# EAGLE board electrosteel2021_synthboards1 (EAGLE 9.6.2)
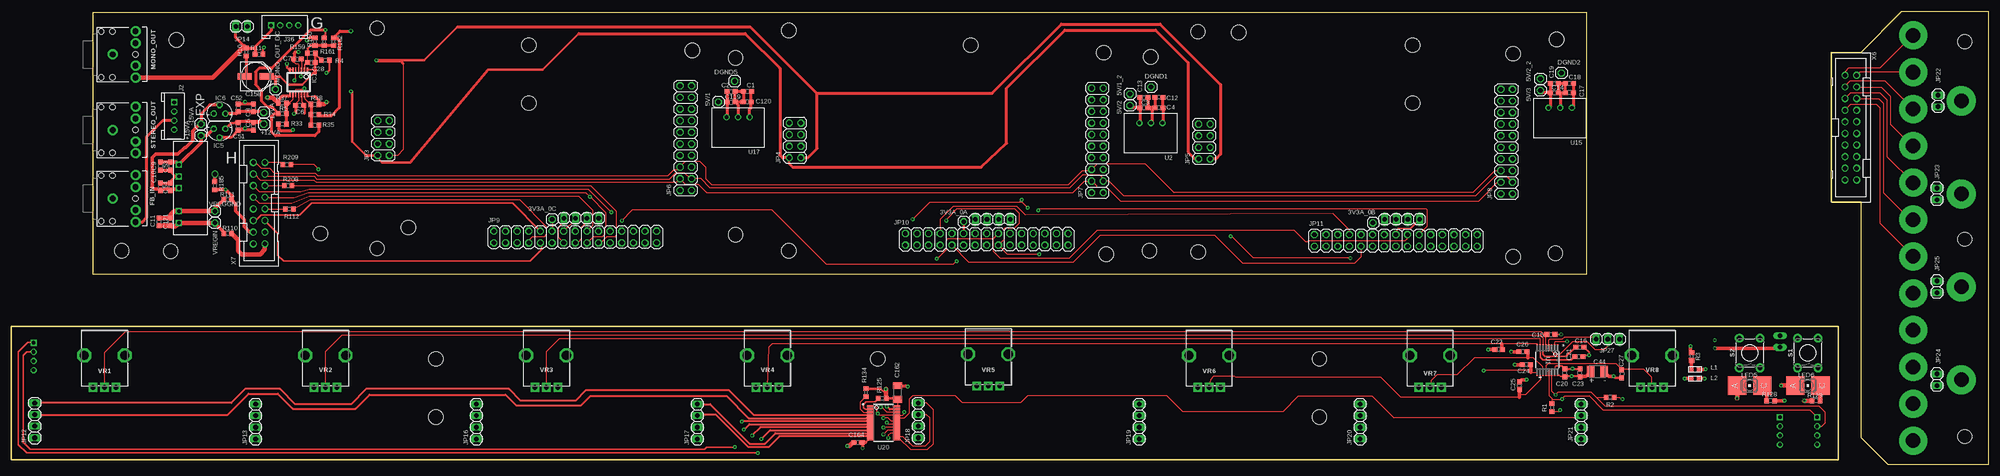
[diagram p2: board, top side]
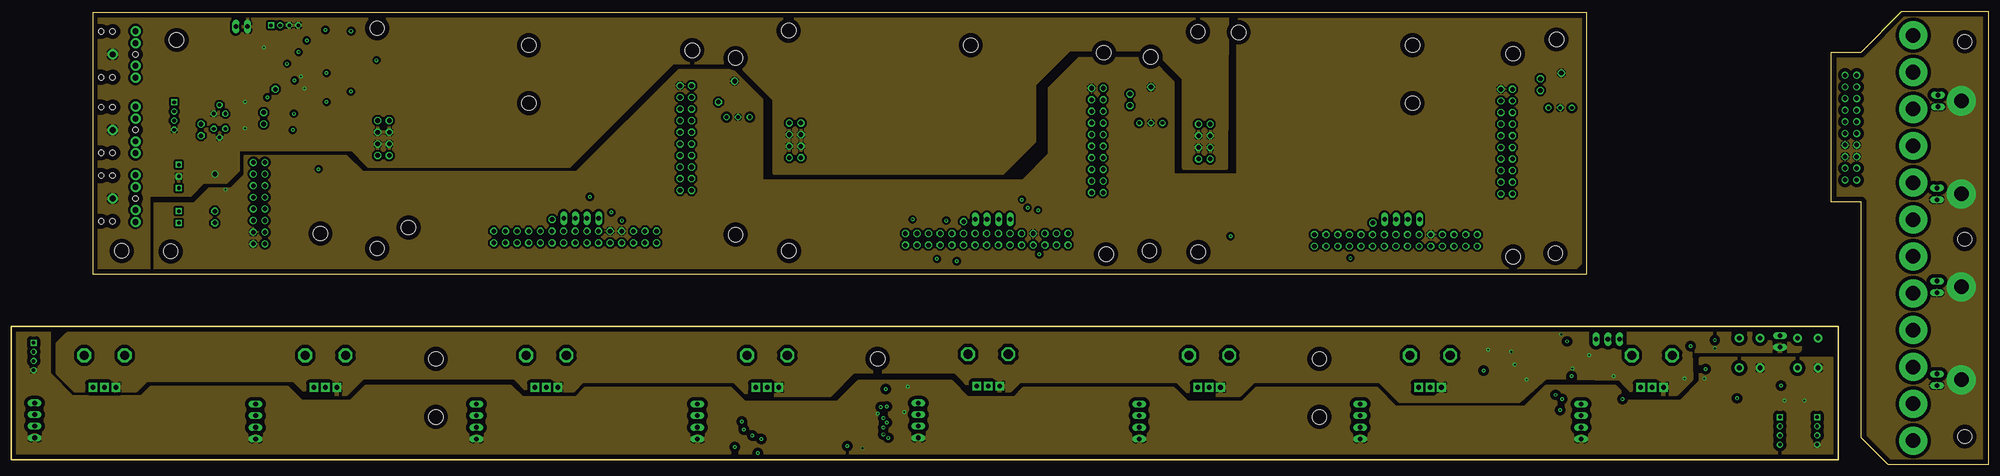
[diagram p3: board, inner layer Route2]
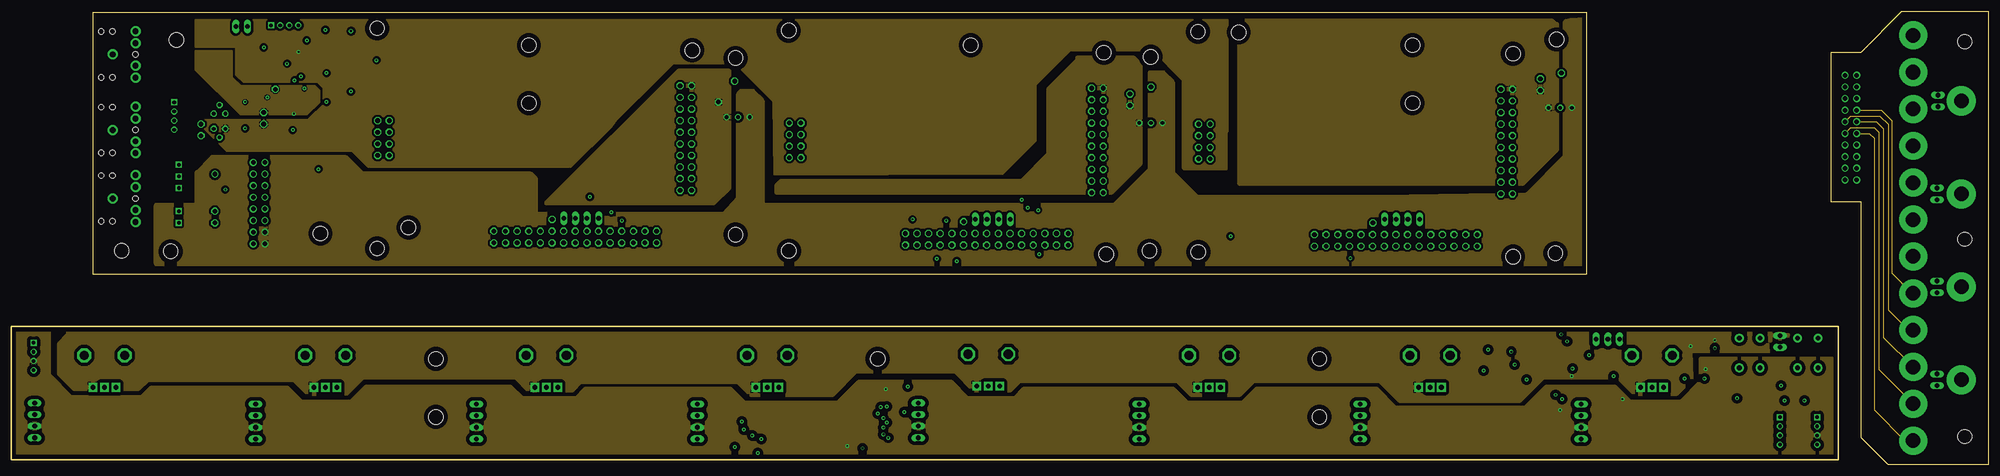
[diagram p4: board, inner layer Route15]
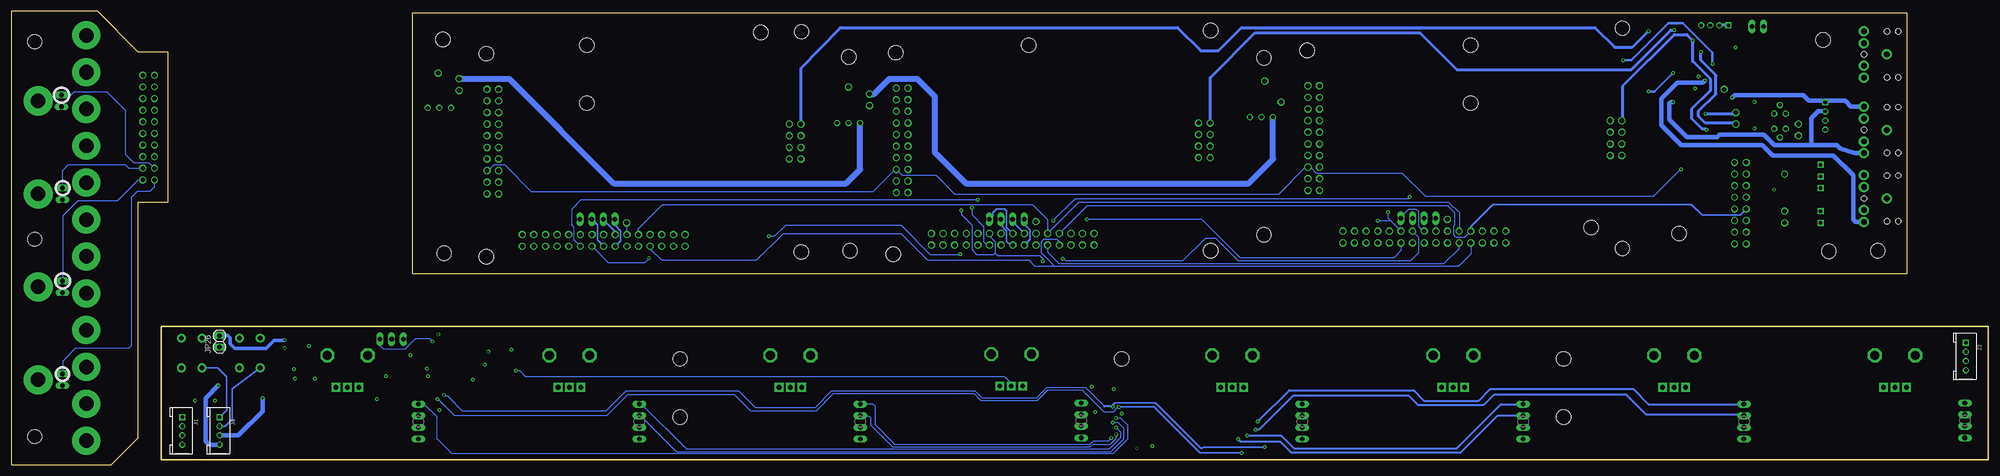
[diagram p5: board, bottom side, seen from below]

Size 431.8 x 99.06 mm. Coordinates in mm from the lower left corner, seen from the top.
Outline: 17.78,98.81 17.78,41.66 344.17,41.66 344.17,98.81 17.78,98.81
Outline: 0,1.02 0,30.23 399.03,30.23 399.03,1.02 0,1.02
Outline: 397.51,90.17 404.11,90.17 413,99.06 431.8,99.06 431.8,0 409.96,0 404.11,5.84 404.11,57.4 397.51,57.4 397.51,90.17
Copper layers (1+2*15+16): Top 0.035mm / dielectric 0.5mm / Route2 0.035mm / dielectric 0.5mm / Route15 0.035mm / dielectric 0.5mm / Bottom 0.035mm
Design rules "default *": minimum track width 6mil, minimum drill 0.35mm, track to track 9mil, track to pad 9mil, pad to pad 9mil, via to via 9mil, smd to smd 9mil, copper to edge 40mil, drill to drill 6mil, minimum pad ring 10mil, minimum via ring 8mil, stop-mask expansion 4mil, vias tented up to drill 0mil, thermal gap 10mil
Holes 3.17 mm at 79.88,95.38 148.72,90.55 79.88,47.24 169.8,94.87 238.63,90.04 169.85,46.71 259.21,94.64 328.02,89.81 259.28,46.46 113.03,78.99 306.07,78.99 36.07,92.84 328.04,45.47 268.1,94.49 86.74,51.82 239.14,45.97 34.8,46.61 248.62,46.71 337.26,46.2 337.52,92.94 248.87,89.13 158.19,88.87 24.08,46.71 158.19,50.27 67.51,50.52 306.07,91.69 209.55,91.69 113.03,91.69 92.71,23.11 92.71,10.41 189.23,23.11 285.75,23.11 285.75,10.41
Holes 3.05 mm at 426.72,92.46 426.72,6.1 426.72,49.28
Milling: 17 lines

## Footprints (pad centres in the part's own frame; a part is rotated, then mirrored left to right if it is on the bottom)
1X01 = drill 1.016 octagon: 1 0,0
C0603 = smd 1.1 x 1: 1 -0.85,0; 2 0.85,0
SMC_B = smd 1.6 x 2.4: + -1.5,0; - 1.5,0
PANASONIC_D = smd 3 x 1.4: + 2.4,0; - -2.4,0
C1206K = smd 1.5 x 2: 1 -1.5,0; 2 1.5,0
AUDIO-JACK-KIT = drill 1.3 pad 2.184: RING 5,5.1; RSH 5,2.5; SLEEVE 0,0; TIP 5,-5.1; TSH 5,-2.5 | hole 1.2: 0,5; -2.5,5; -2.5,-5; 0,-5; 5,0
TSSOP14 = smd 0.305 x 0.991: 1 -1.905,-2.718; 2 -1.27,-2.718; 3 -0.635,-2.718; 4 0,-2.718; 5 0.635,-2.718; 6 1.27,-2.718; 7 1.905,-2.718; 8 1.905,2.718; 9 1.27,2.718; 10 0.635,2.718; 11 0,2.718; 12 -0.635,2.718; 13 -1.27,2.718; 14 -1.905,2.718
78LXX = drill 0.813 octagon: GND 0,1.905; IN 1.27,0; OUT -1.27,0
79LXX = drill 0.813 octagon: GND -1.27,0; IN 0,1.905; OUT 1.27,0
HW4-2.0 = drill 0.8 pad 1.27 square: 1 -3,0 | drill 0.8 pad 1.27: 2 -1,0; 3 1,0; 4 3,0
1X04 = drill 1.016 long: 1 -3.81,0; 2 -1.27,0; 3 1.27,0; 4 3.81,0
2X04 = drill 1.016 octagon: 1 -3.81,-1.27; 2 -3.81,1.27; 3 -1.27,-1.27; 4 -1.27,1.27; 5 1.27,-1.27; 6 1.27,1.27; 7 3.81,-1.27; 8 3.81,1.27
2X10 = drill 1.016 octagon: 1 -11.43,-1.27; 2 -11.43,1.27; 3 -8.89,-1.27; 4 -8.89,1.27; 5 -6.35,-1.27; 6 -6.35,1.27; 7 -3.81,-1.27; 8 -3.81,1.27; 9 -1.27,-1.27; 10 -1.27,1.27; 11 1.27,-1.27; 12 1.27,1.27; 13 3.81,-1.27; 14 3.81,1.27; 15 6.35,-1.27; 16 6.35,1.27; 17 8.89,-1.27; 18 8.89,1.27; 19 11.43,-1.27; 20 11.43,1.27
2X15 = drill 1.016 octagon: 1 -17.78,-1.27; 2 -17.78,1.27; 3 -15.24,-1.27; 4 -15.24,1.27; 5 -12.7,-1.27; 6 -12.7,1.27; 7 -10.16,-1.27; 8 -10.16,1.27; 9 -7.62,-1.27; 10 -7.62,1.27; 11 -5.08,-1.27; 12 -5.08,1.27; 13 -2.54,-1.27; 14 -2.54,1.27; 15 0,-1.27; 16 0,1.27; 17 2.54,-1.27; 18 2.54,1.27; 19 5.08,-1.27; 20 5.08,1.27; 21 7.62,-1.27; 22 7.62,1.27; 23 10.16,-1.27; 24 10.16,1.27; 25 12.7,-1.27; 26 12.7,1.27; 27 15.24,-1.27; 28 15.24,1.27; 29 17.78,-1.27; 30 17.78,1.27
1X02 = drill 1.016 long: 1 -1.27,0; 2 1.27,0
1X03 = drill 1.016 long: 1 -2.54,0; 2 0,0; 3 2.54,0
INDUCTOR_L0603 = smd 0.889 x 0.889: 1 -0.762,0; 2 0.762,0
P-LCC-2 = smd 4 x 4: A 0,2.75; C 0,-2.75
R0603 = smd 1 x 1.1: 1 -0.85,0; 2 0.85,0
TACTILE_SWITCH_PTH_6.0MM = drill 1.016 pad 1.88: 1 -3.251,2.261; 2 3.251,2.261; 3 -3.251,-2.261; 4 3.251,-2.261
21-0055H_16_MXM = smd 1.46 x 0.356: 1 -2.724,2.223; 2 -2.724,1.587; 3 -2.724,0.953; 4 -2.724,0.318; 5 -2.724,-0.318; 6 -2.724,-0.953; 7 -2.724,-1.587; 8 -2.724,-2.223; 9 2.724,-2.223; 10 2.724,-1.587; 11 2.724,-0.953; 12 2.724,-0.318; 13 2.724,0.318; 14 2.724,0.953; 15 2.724,1.587; 16 2.724,2.223
DC-DC_CONVERTER_78XX = drill 0.8: GND 0,0; VIN -2.54,0; VOUT 2.54,0
SOP65P640X120-24N = smd 1.57 x 0.41: 1 -2.87,3.575; 2 -2.87,2.925; 3 -2.87,2.275; 4 -2.87,1.625; 5 -2.87,0.975; 6 -2.87,0.325; 7 -2.87,-0.325; 8 -2.87,-0.975; 9 -2.87,-1.625; 10 -2.87,-2.275; 11 -2.87,-2.925; 12 -2.87,-3.575; 13 2.87,-3.575; 14 2.87,-2.925; 15 2.87,-2.275; 16 2.87,-1.625; 17 2.87,-0.975; 18 2.87,-0.325; 19 2.87,0.325; 20 2.87,0.975; 21 2.87,1.625; 22 2.87,2.275; 23 2.87,2.925; 24 2.87,3.575
CMR0512S3C = drill 0.8 square: P$1 -7.62,0; P$2 -5.08,0; P$3 0,0; P$4 2.54,0; P$5 5.08,0
POT-PTH-ALPS = drill 1 pad 1.88 square: P$1 7,-2.5; P$2 7,0; P$3 7,2.5 | drill 2 octagon: P$4 0,-4.4; P$5 0,4.4
PAK100/2500-20 = drill 1 pad 1.422: 1 -11.43,-1.27; 2 -11.43,1.27; 3 -8.89,-1.27; 4 -8.89,1.27; 5 -6.35,-1.27; 6 -6.35,1.27; 7 -3.81,-1.27; 8 -3.81,1.27; 9 -1.27,-1.27; 10 -1.27,1.27; 11 1.27,-1.27; 12 1.27,1.27; 13 3.81,-1.27; 14 3.81,1.27; 15 6.35,-1.27; 16 6.35,1.27; 17 8.89,-1.27; 18 8.89,1.27; 19 11.43,-1.27; 20 11.43,1.27
PAK100/2500-16 = drill 1 pad 1.422: 1 -8.89,-1.27; 2 -8.89,1.27; 3 -6.35,-1.27; 4 -6.35,1.27; 5 -3.81,-1.27; 6 -3.81,1.27; 7 -1.27,-1.27; 8 -1.27,1.27; 9 1.27,-1.27; 10 1.27,1.27; 11 3.81,-1.27; 12 3.81,1.27; 13 6.35,-1.27; 14 6.35,1.27; 15 8.89,-1.27; 16 8.89,1.27

## Placement (x,y rotation side)
3V3A_0A  PINHD-1X1  [1X01]  208.03,53.09 0 top
3V3A_0B  PINHD-1X1  [1X01]  297.43,52.83 0 top
3V3A_0C  PINHD-1X1  [1X01]  118.11,53.59 0 top
5V/1  PINHD-1X1  [1X01]  154.43,79.25 0 top
5V/1_2  PINHD-1X1  [1X01]  244.35,81.03 0 top
5V/2  PINHD-1X1  [1X01]  244.35,78.49 0 top
5V/2_2  PINHD-1X1  [1X01]  334.01,84.33 0 top
5V/3  PINHD-1X1  [1X01]  334.01,81.79 0 top
+12VA  PINHD-1X1  [1X01]  55.12,74.42 0 top
+15VA  PINHD-1X1  [1X01]  41.4,71.88 180 top
-12VA  PINHD-1X1  [1X01]  55.12,76.96 180 top
-15VA  PINHD-1X1  [1X01]  41.4,74.42 180 top
C1  .1uf  [C0603]  160.78,81.53 180 top
C2  .1uf  [C0603]  157.23,81.53 0 top
C3  .01uf  [C0603]  247.4,77.98 0 top
C4  .01uf  [C0603]  250.7,77.98 180 top
C5  .1uf  [C0603]  52.83,73.91 270 top
C6  .1uf  [C0603]  62.99,78.49 180 top
C7  .1uf  [C0603]  62.48,88.65 0 top
C8  .1uf  [C0603]  52.83,77.98 270 top
C9  .1uf  [C0603]  32.51,65.28 270 top
C10  .1uf  [C0603]  32.51,60.71 270 top
C11  .1uf  [C0603]  32.26,53.09 90 top
C12  .1uf  [C0603]  250.7,80.26 180 top
C13  .1uf  [C0603]  247.4,80.26 0 top
C14  .01uf  [C0603]  337.06,81.28 0 top
C15  .01uf  [C0603]  336.3,28.45 0 top
C16  .01uf  [C0603]  342.65,25.65 0 top
C17  .01uf  [C0603]  340.36,81.28 180 top
C18  .1uf  [C0603]  340.36,83.31 180 top
C19  .1uf  [C0603]  337.06,83.31 0 top
C20  .01uf  [C0603]  339.34,20.07 90 top
C21  .01uf  [C0603]  342.39,23.62 0 top
C22  .01uf  [C0603]  324.87,25.15 180 top
C23  .1uf  [C0603]  342.65,20.07 90 top
C24  .01uf  [C0603]  330.96,21.84 180 top
C25  .01uf  [C0603]  329.44,17.27 90 top
C26  .01uf  [C0603]  330.2,24.64 180 top
C27  .01uf  [C0603]  351.79,19.81 270 top
C28  22pf  [C0603]  65.53,87.88 0 top
C44  10uf  [SMC_B]  346.46,20.32 0 top
C51  .01uf  [C0603]  49.53,73.91 270 top
C52  .01uf  [C0603]  49.53,77.98 270 top
C53  .01uf  [C0603]  34.8,65.28 270 top
C54  .01uf  [C0603]  34.8,60.71 270 top
C119  .01uf  [C0603]  157.23,79.25 0 top
C120  .01uf  [C0603]  160.73,79.27 180 top
C121  .01uf  [C0603]  34.8,53.09 90 top
C158  22uf  [PANASONIC_D]  53.34,84.84 0 top
C162  1uf  [C1206K]  193.55,15.75 90 top
C164  .1uf  [C0603]  184.91,4.83 0 top
DGND1  PINHD-1X1  [1X01]  248.92,82.55 0 top
DGND2  PINHD-1X1  [1X01]  338.58,85.6 0 top
DGND5  PINHD-1X1  [1X01]  157.99,83.82 180 top
FB_IN  AUDIO_JACK_3.5MM_KIT  [AUDIO-JACK-KIT]  22.1,58.17 0 top
IC1  OPA4344E  [TSSOP14]  62.74,83.57 180 top
IC5  [78LXX]  45.47,73.41 180 top
IC6  [79LXX]  45.47,76.71 0 top
J1  4P-2.0  [HW4-2.0]  394.46,7.37 270 bottom
J2  4P-2.0  [HW4-2.0]  35.56,76.2 270 top
J3  4P-2.0  [HW4-2.0]  4.83,23.62 270 bottom
J4  4P-2.0  [HW4-2.0]  386.33,7.37 270 bottom
J36  4P-2.0  [HW4-2.0]  59.69,96.01 0 top
JP1  PINHD-1X4  [1X04]  124.46,53.85 180 top
JP2  PINHD-1X4  [1X04]  214.38,53.59 180 top
JP3  PINHD-2X4  [2X04]  81.28,71.37 90 top
JP4  PINHD-2X4  [2X04]  171.2,70.87 90 top
JP5  PINHD-2X4  [2X04]  260.6,70.61 90 top
JP6  PINHD-2X10  [2X10]  147.32,71.37 90 top
JP7  PINHD-2X10  [2X10]  237.24,70.87 90 top
JP8  PINHD-2X10  [2X10]  326.64,70.61 90 top
JP9  [2X15]  123.16,49.73 0 top
JP10  [2X15]  213.06,49.25 0 top
JP11  [2X15]  302.44,49 0 top
JP12  PINHD-1X4  [1X04]  5.08,9.65 90 top
JP13  PINHD-1X4  [1X04]  53.34,9.4 90 top
JP14  PINHD-1X2  [1X02]  50.29,95.76 0 top
JP15  PINHD-1X4  [1X04]  303.78,53.59 180 top
JP16  PINHD-1X4  [1X04]  101.6,9.4 90 top
JP17  PINHD-1X4  [1X04]  149.86,9.4 90 top
JP18  PINHD-1X4  [1X04]  198.12,9.65 90 top
JP19  PINHD-1X4  [1X04]  246.38,9.4 90 top
JP20  PINHD-1X4  [1X04]  294.64,9.4 90 top
JP21  PINHD-1X4  [1X04]  342.9,9.4 90 top
JP22  PINHD-1X2  [1X02]  420.88,79.5 270 top
JP23  PINHD-1X2  [1X02]  420.62,59.18 270 top
JP24  PINHD-1X2  [1X02]  420.62,18.54 270 top
JP25  PINHD-1X2  [1X02]  420.62,38.86 270 top
JP26  PINHD-1X2  [1X02]  386.33,26.92 90 bottom
JP27  PINHD-1X3  [1X03]  348.74,27.43 0 top
L1  [INDUCTOR_L0603]  367.79,20.83 0 top
L2  [INDUCTOR_L0603]  367.79,18.8 0 top
LED5  GREEN  [P-LCC-2]  379.73,17.27 90 top
LED6  RED  [P-LCC-2]  392.43,17.27 90 top
MONO_OUT  AUDIO_JACK_3.5MM_KIT  [AUDIO-JACK-KIT]  22.1,89.66 0 top
MONO_OUT_DC  PINHD-1X1  [1X01]  57.66,82.04 0 top
R1  2.2k-DNP  [R0603]  336.55,12.45 90 top
R2  2.2k-DNP  [R0603]  349.25,14.73 180 top
R3  5R  [R0603]  367.03,23.62 270 top
R4  0R  [R0603]  68.58,88.39 0 top
R5  7.15k  [R0603]  59.18,76.71 0 top
R10  560R  [R0603]  51.31,90.17 90 top
R11  47k  [R0603]  54.1,89.66 180 top
R33  10k  [R0603]  59.18,74.42 0 top
R34  10k  [R0603]  66.29,76.45 180 top
R35  7.15k  [R0603]  66.29,74.17 180 top
R37  10k  [R0603]  59.18,78.99 180 top
R38  10k  [R0603]  66.29,78.74 0 top
R110  0R  [R0603]  47.24,50.55 0 top
R111  0R  [R0603]  47.24,57.91 0 top
R112  39R  [R0603]  60.71,55.88 180 top
R125  1k  [R0603]  190.25,14.48 180 top
R128  4.7k  [R0603]  384.3,13.97 0 top
R129  560R  [R0603]  394.21,13.97 180 top
R134  1k  [R0603]  186.69,15.75 90 top
R159  10k  [R0603]  65.53,89.92 0 top
R160  10k  [R0603]  66.29,92.46 270 top
R161  10k  [R0603]  68.33,92.46 270 top
R162  10k  [R0603]  70.36,92.46 270 top
R185  0R  [R0603]  44.45,60.96 90 top
R208  39R  [R0603]  60.45,60.96 180 top
R209  39R  [R0603]  60.2,65.53 180 top
S1  MOMENTARY-SWITCH-SPST-PTH-6.0MM  [TACTILE_SWITCH_PTH_6.0MM]  392.43,24.38 90 top
S2  MOMENTARY-SWITCH-SPST-PTH-6.0MM  [TACTILE_SWITCH_PTH_6.0MM]  379.73,24.38 90 top
STEREO_OUT  AUDIO_JACK_3.5MM_KIT  [AUDIO-JACK-KIT]  22.1,73.15 0 top
U1  MAX11615EEE+  [21-0055H_16_MXM]  335.53,22.86 270 top
U2  R-78E5.0-1.0  [DC-DC_CONVERTER_78XX]  248.92,74.68 180 top
U15  R-78E5.0-1.0  [DC-DC_CONVERTER_78XX]  338.33,77.98 180 top
U17  R-78E5.0-1.0  [DC-DC_CONVERTER_78XX]  158.75,75.95 180 top
U20  TCA9548APWR  [SOP65P640X120-24N]  190.5,9.14 0 top
U$3  CMR0512S3C  [CMR0512S3C]  36.58,60.45 90 top
VR1  10k  [POT-PTH-ALPS]  20.32,23.88 270 top
VR2  10k  [POT-PTH-ALPS]  68.58,23.88 270 top
VR3  10k  [POT-PTH-ALPS]  116.84,23.88 270 top
VR4  10k  [POT-PTH-ALPS]  165.1,23.88 270 top
VR5  10k  [POT-PTH-ALPS]  213.36,24.13 270 top
VR6  10k  [POT-PTH-ALPS]  261.62,23.88 270 top
VR7  10k  [POT-PTH-ALPS]  309.88,23.88 270 top
VR8  10k  [POT-PTH-ALPS]  358.39,23.88 270 top
VREGGND  PINHD-1X1  [1X01]  44.45,55.37 180 top
VREGIN  PINHD-1X1  [1X01]  44.45,52.83 180 top
X6  2520-  [PAK100/2500-20]  401.83,73.66 270 top
X7  2516-  [PAK100/2500-16]  54.1,57.15 90 top

## Tracks (layer width: path | path; a pad name or v marks a point on that pad's centre or on a via)
3V3D3  (via drill 0.35)
  Top 0.2: R2.1 351.28,14.73 351.79,14.22 v351.92,14.35 | R1.1 337.99,11.6 v338.33,11.94
  Top 0.254: C162.1 193.55,12.9 U20.24
  Top 0.508: C162.1 193.32,14.48 R125.1 191.1,15.41 189.9,16.6 R134.2
  Top 0.813: v370.08,20.83 L1.2
  Top 1.016: R125.1 191.1,16.42 v191.01,16.51 | C164.1 183.9,4.83 183.13,4.06 v182.63,4.06
  pour Route15 (isolate 0.762): 0.25,2.29 0.25,30.03 7.87,29.97 8.13,29.72 8.13,19.56 12.95,14.73 28.45,14.73 30.48,16.76 60.2,16.76 63.25,13.72 74.17,13.72 77.47,17.02 108.97,17.02 111.51,14.48 123.44,14.48 125.48,16.51 156.97,16.51 160.02,13.46 180.59,13.46 185.17,18.03 205.23,18.03 208.79,14.48 219.2,14.48 221.23,16.51 253.75,16.51 256.79,13.46 268.99,13.46 272.03,16.51 298.2,16.51 302.26,12.45 330.71,12.45 335.28,17.02 350.27,17.02 353.57,13.72 364.74,13.72 369.06,18.03 369.06,23.11 397.76,23.11 397.76,2.29
+3.3V  (via drill 0.35)
  Top 0.254: U1.16 337.76,19.88 338.33,19.3 | 342.56,19.3 C23.1
  Top 0.305: 338.33,19.3 v340.87,19.3
  Top 0.406: 342.56,19.3 v340.87,19.3 339.43,19.3 C20.1
  Top 0.813: R3.1 366.78,24.73 v366.78,25.91 | C23.1 342.73,19.3 343.94,19.3 C44.+
  Bottom 0.813: JP26.2 384.56,28.19 384.05,27.69 384.05,26.42 383.03,25.4 376.17,25.4 374.4,27.18 v372.11,27.18
  pour Route15 (isolate 0.762): 14.22,30.73 12.45,28.96 12.45,28.45 10.41,26.42 10.41,19.81 13.72,16.51 27.69,16.51 29.72,18.54 61.72,18.54 64.77,15.49 73.15,15.49 76.71,19.05 110.24,19.05 113.03,16.26 122.43,16.26 124.21,18.03 158.75,18.03 161.54,15.24 179.32,15.24 184.4,20.32 206.25,20.32 210.31,16.26 218.19,16.26 220.22,18.29 254.76,18.29 257.81,15.24 268.22,15.24 271.27,18.29 298.96,18.29 303.28,13.97 329.44,13.97 334.52,19.05 351.03,19.05 354.58,15.49 363.73,15.49 367.03,18.8 366.78,24.89 390.4,24.89 390.65,25.15 390.65,30.23 14.73,30.23
+5V/1
  Top 0.61: U17.VOUT 156.38,76.11 C119.1 C2.1
  Bottom 1.27: 5V/1_2.1 243.33,81.03 240.03,84.33 233.93,84.33 230.12,80.52 230.12,68.33 223.27,61.47 161.54,61.47 156.21,66.8 U17.VOUT
  pour Route15 (isolate 0.508): 156.72,86.11 156.72,60.45 153.42,57.15 116.84,57.15 145.8,86.11
+5V/2
  Top 0.61: C3.1 244.86,77.98 5V/2.1 | C13.1 C3.1 | C3.1 246.55,74.84 U2.VOUT
  Bottom 1.27: 5V/2_2.1 323.09,84.33 300.23,61.47 249.43,61.47 246.38,64.52 U2.VOUT
  pour Route15 (isolate 0.508): 246.63,87.38 246.63,65.79 240.28,59.44 167.13,59.44 167.13,60.96 168.15,61.98 220.73,61.98 226.57,67.82 226.57,82.04 232.92,88.39 232.92,88.9 245.11,88.9
+5V/3
  Top 0.61: C19.1 C14.1 | C14.1 336.21,78.4 U15.VOUT | C14.1 334.52,81.28 5V/3.1
  pour Route15 (isolate 0.508): 337.57,96.27 337.57,68.83 330.2,61.47 268.22,61.47 268.22,97.03 336.55,97.03 337.31,96.27
+9V  (via drill 0.35)
  Top 0.254: 61.65,88.09 62.1,87.63 62.61,87.63 62.78,87.46 62.78,86.33 IC1.4
  Top 0.406: C5.1 54.78,74.76 +12VA.1
  Top 0.61: IC5.OUT 47.84,74.52 C51.1 49.7,74.93 54.61,74.93 +12VA.1 | 61.65,88.09 61.63,88.1 C7.1 61.72,88.73 61.72,89.92 61.98,90.17 v62.74,90.17
  Bottom 0.61: +12VA.1 55.37,74.68 61.72,74.68 63.25,76.2 63.25,77.22 59.44,81.03 59.44,85.09 62.74,88.39 v62.74,90.17
  pour Route15 (isolate 0.508, rank 2): 40.13,75.44 64.77,75.44 68.07,78.74 68.07,82.04 66.55,83.57 50.55,83.57 49.02,85.09 49.02,91.19 40.13,91.19 40.13,97.28 265.77,97.28 265.77,72.9 265.51,72.64 265.51,64.52 256.12,64.52 255.86,64.77 255.86,84.07 249.51,90.42 231.22,90.42 223.86,83.06 223.86,70.87 216.48,63.49 166.63,63.33 166.43,79.45 158.24,87.63 144.53,87.63 141.48,84.58 132.2,75.44 131.06,73.91 122.17,65.02 77.98,65.02 74.42,68.58 46.99,68.58
+12V
  Top 0.61: U17.VIN 161.29,77.72 161.58,78.02 C120.1 161.58,81.48 C1.1 | C18.1 C17.1 341.21,78.32 U15.VIN | U2.VIN 251.55,74.76 C4.1 C12.1
  Top 1.016: R110.2 49.53,49.11 49.53,46.74 50.29,45.97 54.36,45.97 55.37,46.99 X7.1
  pour Route15 (isolate 0.508): 342.9,43.94 31.75,43.94 31.75,56.64 40.64,56.64 40.64,63.75 43.94,67.06 72.9,67.06 76.45,63.5 113.28,63.5 114.3,62.48 114.3,54.61 155.69,54.61 159,58.27 159,81.03 159.51,81.53 161.8,81.53 163.83,79.5 163.83,56.64 241.05,56.64 248.92,64.52 248.92,85.6 251.46,85.6 253.49,83.57 253.49,63.75 258.83,58.42 298.96,58.42 331.22,58.93 339.6,67.31 339.6,96.77 340.61,97.03 342.39,97.03 343.15,97.79 343.15,44.2
-9V  (via drill 0.35)
  Top 0.254: IC1.11 62.74,79.5 62.14,78.91 C6.2
  Top 0.61: -12VA.1 54.95,77.13 C8.2 C52.2 49.11,76.71 IC6.OUT | C6.2 62.14,76.87 61.98,76.71 v61.72,76.71
  Bottom 0.61: v61.72,76.71 55.37,76.71 -12VA.1
  pour Route15 (isolate 0.254): 48.26,90.42 40.13,90.42 40.13,86.36 50.04,76.45 64.52,76.45 67.31,79.25 67.31,81.79 66.29,82.8 50.04,82.8 48.26,84.58
A_IN  (via drill 0.35)
  Top 0.406: R4.2 69.43,86.19 v68.83,85.6
  Top 0.508: v74.17,81.53 74.42,81.53 74.42,70.61 77.47,67.56 JP3.2 80.01,67.06 81.03,66.04 87.12,66.04 104.14,86.36 116.08,86.36 123.95,94.23 | JP4.2 169.93,65.79
  Top 0.61: JP4.2 168.4,67.06 167.89,67.56 167.89,86.61 160.27,94.23 123.95,94.23 | JP5.2 258.57,66.8 257.05,68.33 257.05,87.88 249.94,95 230.12,95 217.42,82.3 217.42,70.26 211.84,65.02 170.69,65.02 169.93,65.79
  Bottom 0.508: v74.17,81.53 72.9,81.53 v68.83,85.6
A_OUT1  (via drill 0.35)
  Top 0.406: 61.21,72.9 v61.47,73.15
  Top 0.61: R160.1 65.11,93.31 v64.52,92.71 | R33.1 58.33,73.41 58.84,72.9 61.21,72.9
  Bottom 0.406: 79.88,75.31 JP3.8
  Bottom 0.61: 79.88,75.31 79.88,82.68 68.58,93.98 65.79,93.98 v64.52,92.71 64.52,88.14 60.71,84.33 60.71,81.79 64.77,77.72 64.77,75.69 62.48,73.41 61.72,73.41 v61.47,73.15
A_OUT2  (via drill 0.35)
  Top 0.305: 58.17,76.96 58.17,76.71
  Top 0.406: v68.58,95 68.58,93.98 68.33,93.73 R161.1 | 58.17,76.71 R5.1
  Top 0.61: R35.1 67.14,72.73 66.29,71.88 57.66,71.88 56.9,72.64 56.9,76.2 57.4,76.71 58.17,76.71 | v68.58,95 65.28,95 56.9,86.61 54.1,86.61 53.34,85.85 53.34,83.06 54.61,81.79 54.61,79.5 55.88,78.23 56.9,78.23 58.17,76.96
  Bottom 0.61: JP4.8 169.93,84.58 160.13,94.37 124.09,94.37 116.08,86.36 77.98,86.36 69.34,95 v68.58,95
A_OUT3  (via drill 0.55)
  Top 0.406: 67.4,76.2 R34.1
  Top 0.61: v74.17,94.74 71.79,94.74 R162.1 71.03,93.31 71.63,92.71 71.63,77.98 69.85,76.2 67.4,76.2
  Bottom 0.61: v74.17,94.74 77.72,91.19 81.53,91.19 85.85,95.5 163.07,95.5 168.15,90.42 171.96,90.42 177.04,95.5 250.7,95.5 259.33,86.61 JP5.8
AGND1  (via drill 0.35)
  Top 0.254: 337.38,21.59 337.12,21.34 U1.15
  Top 0.305: 337.38,21.59 338.67,21.59 C20.2 | C21.2 343.5,23.88 v344.68,23.88 344.68,24.47 C16.2 | v338.58,28.45 C15.2
  Top 0.406: C20.2 339.38,20.95 v341,20.95 342.61,20.95 C23.2
  Top 0.508: C27.2 350.35,18.96 v350.01,19.3
  Top 0.813: JP26.1 386.08,25.4 v372.11,25.4 | L2.1 v365.51,18.8 | C26.2 v327.66,24.64 | C25.2 329.86,18.54 v330.96,18.54 | C24.2 v328.42,21.84 | C22.2 v322.58,25.15 | C44.- 348.97,19.3 v350.01,19.3
  pour Route2 (isolate 0.762): 14.21,30.47 10.16,26.42 10.16,20.07 13.97,16.26 27.18,16.26 29.46,18.54 61.72,18.54 64.77,15.49 73.15,15.49 76.71,19.05 109.98,19.05 112.78,16.26 122.68,16.26 124.71,18.29 157.99,18.29 161.04,15.24 178.82,15.24 183.9,20.32 206.25,20.32 210.31,16.26 218.19,16.26 220.22,18.29 254.76,18.29 257.81,15.24 268.22,15.24 271.27,18.29 298.96,18.29 303.28,13.97 329.3,13.97 335.14,19.03 351.45,18.79 354.54,15.49 363.73,15.49 366.98,18.74 366.78,24.89 390.4,24.89 390.65,25.15 390.65,30.23 367.03,30.23 367.03,30.22
AGND3  (via drill 3.17 pad 6.35)
  other vias: 425.96,79.5 425.96,59.18 425.96,38.86 425.96,18.54
  pour Route2 (isolate 0.762): 431.8,99.06 431.8,0 409.96,0 404.11,5.84 404.11,56.13 402.84,57.4 398.02,57.4 397.76,57.15 397.76,89.92 403.86,89.92 413,99.06
AGND5  (via drill 0.35, 1)
  Top 0.254: 34.3,64.26 34.54,64.26 34.67,64.39 34.8,64.52 C53.2 34.8,64.01 | 34.3,61.72 34.54,61.72 34.8,61.47 C54.1 34.8,61.98 | 49.78,73.41 C51.2 | 63.37,88.89 63.37,88.65 IC1.3 63.37,84.96 v63.25,84.84 | C6.1 63.84,78.91 63.37,79.38 IC1.12 63.37,81.79 63.37,81.92 63.25,82.04 62.23,82.04 62.1,81.92 IC1.10
  Top 0.406: R11.1 54.95,91.02 v55.12,91.19 | 34.63,64.43 34.67,64.39 | C6.1 64.01,78.32 64.01,76.71 | 63.37,81.79 63.63,82.04 63.85,82.04 v64.01,82.2 | v51.05,79.25 50.55,78.74 49.62,78.74 C52.1 | 51.05,73.15 49.62,73.15 C51.2 49.97,73.51 v51.05,73.51
  Top 0.61: 35.81,62.99 U$3.P$4 | 34.8,64.01 35.81,62.99 | 34.8,61.98 35.81,62.99 | C9.2 34.63,64.43 | C10.1 34.38,61.56 34.54,61.72 | C5.2 C51.2 47.97,71.5 IC5.GND | C8.1 C52.1 | C7.2 63.37,88.65
  Top 0.813: R185.2 v44.45,63.5
  pour Route2 (isolate 0.508): 30.23,58.93 39.12,58.93 41.91,61.72 46.99,61.72 49.53,64.26 49.53,68.83 74.42,68.83 77.98,65.28 121.92,65.28 144.53,87.88 158.5,87.88 166.62,79.76 166.62,63.75 216.66,63.75 223.52,70.61 223.52,83.06 231.14,90.68 249.68,90.68 256.03,84.33 256.03,64.83 265.41,64.77 265.68,97.75 251.97,98.3 18.29,98.3 18.03,98.55 18.03,42.16 29.72,42.16 29.97,42.42 29.97,58.67
B_IN1  (via drill 0.35)
  Top 0.254: IC1.7 IC1.6 60.71,86.28 | 85.6,87.63 85.6,68.83 84.33,67.56 JP3.1 | 176.02,81.03 175.9,81.15
  Top 0.508: v60.2,87.63 60.2,86.79 60.71,86.28 | 97.41,95.63 90.17,88.39 v79.76,88.39 80.01,88.14 85.09,88.14 85.6,87.63
  Top 0.61: JP4.1 173.99,67.06 176.02,69.09 176.02,81.03 | 97.41,95.63 161.42,95.63 175.9,81.15 214.25,81.15 229.36,96.27 250.95,96.27 264.16,83.06 264.16,67.82 263.14,66.8 JP5.1
  Bottom 0.508: v60.2,87.63 60.2,90.08 66.64,96.52 69.85,96.52 77.98,88.39 v79.76,88.39
DGND4  (via drill 0.35)
  Top 0.61: C119.2 C2.2 C1.2 159.88,81.48 C120.2 159.86,79.25 C119.2 | C119.2 158.75,78.57 U17.GND | C14.2 C19.2 C18.2 C17.2 C14.2 | C14.2 338.33,80.86 U15.GND | C13.2 C3.2 249.17,77.98 | C12.2 C4.2 249.17,77.98 | 249.17,77.98 249.17,74.93 U2.GND
  Top 0.813: R185.1 46.82,60.11 48.26,58.67 48.26,58.08 R111.2 49.02,56.98 49.02,55.37 50.8,53.59 50.8,52.07 52.07,50.8 X7.4
  other vias: 46.74,60.12
  pour Route2 (isolate 0.508): 31.24,42.42 31.24,57.15 39.88,57.15 43.18,60.45 48.01,60.45 50.8,63.25 50.8,67.56 73.15,67.56 76.71,64.01 123.44,64.01 145.8,86.36 157.48,86.36 164.08,79.76 164.08,62.23 220.98,62.23 226.57,67.82 226.57,82.3 233.17,88.9 248.67,88.9 254,83.57 254,63.5 267.72,63.5 267.72,97.03 268.22,97.54 344.68,97.54 344.68,45.72 341.38,42.42
GND-ISO  (via drill 0.35)
  Top 0.2: U20.21 194.67,10.77 195.07,11.18 v195.07,11.43
  Top 0.254: 194.33,17.25 C162.2 | U20.1 188.7,12.72 188.98,12.45 188.98,11.18 189.1,11.05 | 189.1,11.05 189.23,10.92 191.13,10.92 191.2,10.86 193.28,10.86 U20.21 | v189.23,11.18 189.1,11.05
  Top 0.305: U20.12 187.38,5.57 186.63,4.83
  Top 0.61: C164.2 v185.93,3.56 | C162.2 195.35,17.25 195.58,17.02 v195.83,17.02
  Top 0.813: 186.63,4.83 C164.2 | R128.2 v387.35,13.97 | v369.82,18.8 L2.2
  Top 1.016: R129.2 v391.67,13.97
  pour Route2 (isolate 0.762): 0.25,29.97 0.25,2.29 397.76,2.29 397.76,23.11 369.06,23.11 369.06,18.03 364.74,13.72 353.57,13.72 350.27,17.02 335.28,17.02 330.71,12.45 302.26,12.45 298.2,16.51 272.03,16.51 268.99,13.46 256.79,13.46 253.75,16.51 221.23,16.51 219.2,14.48 208.79,14.48 205.23,18.03 185.17,18.03 180.59,13.46 160.02,13.46 156.97,16.51 125.48,16.51 123.44,14.48 111.51,14.48 108.97,17.02 77.47,17.02 74.17,13.72 63.25,13.72 60.2,16.76 30.48,16.76 28.45,14.73 13.21,14.73 8.13,19.81 8.13,29.72 7.87,29.97
MASTERSCL  (via drill 0.35)
  Top 0.2: 336.55,14.22 R1.2
  Top 0.254: U20.22 191.27,11.42 190.12,12.57 v189.87,12.57 | 336.55,14.22 338.71,14.22 v338.71,14.35 339.34,14.99 344.68,14.99 347.77,11.89 392.94,11.89 J1.1 | U1.13 335.85,15.18 336.55,14.48 R1.2
  Top 0.305: v163.07,2.54 3.3,2.54 1.52,4.32 1.52,24.64 3.56,26.67 4.57,26.67
  Top 0.813: J3.1 4.62,26.62 4.57,26.67
  Bottom 0.254: v189.87,12.57 190.1,12.57 191.21,11.46 193.07,11.46 197.81,16.2 205.51,16.2 207.8,13.92 219.94,13.92 221.47,15.44 252.27,15.44 256.03,11.68 270.26,11.68 273.81,15.24 297.18,15.24 301.75,10.67 335.03,10.67 v338.71,14.35
  Bottom 0.305: v189.87,12.57 182.25,12.57 172.21,2.54 v163.07,2.54
MASTERSDA  (via drill 0.35)
  Top 0.2: R2.2 348.27,14.61 346.33,14.61
  Top 0.254: U1.14 336.55,20.07 336.55,16 v337.31,15.24 337.82,15.75 345.19,15.75 346.33,14.61 348.23,12.7 394.97,12.7 396.24,11.43 396.25,9.13 395.48,8.37 J1.2
  Top 0.305: v157.99,3.81 151.89,3.81 151.38,3.3 4.06,3.3 2.54,4.83 2.54,23.88 3.3,24.64 4.81,24.64
  Top 0.406: U20.23 191.89,12.07 v191.26,12.7
  Top 0.813: J3.2 4.81,24.64
  Bottom 0.254: 193.04,12.7 197.1,16.76 205.74,16.76 208.03,14.48 219.71,14.48 221.23,16 252.73,16 256.29,12.45 269.24,12.45 272.8,16 297.69,16 302.01,11.68 333.25,11.68 336.55,14.99 337.06,14.99 v337.31,15.24
  Bottom 0.305: v191.26,12.7 191.26,12.95 190.75,13.46 181.86,13.46 171.96,3.56 171.7,3.56 171.45,3.81 v157.99,3.81
  Bottom 0.406: v191.26,12.7 193.04,12.7
MONO_OUTPUT
  Top 0.305: IC1.1 66.38,86.28
  Top 0.508: C158.+ 57.66,84.84 58.67,84.84 60.45,83.06 63.5,83.06 65.96,85.52 66.31,85.52 | 66.38,86.28 C28.2 R159.2 66.38,89.74 R4.1
  Top 0.61: 57.66,84.84 MONO_OUT_DC.1
  Top 0.813: 66.31,85.52 66.38,85.6 66.38,86.28
N$1
  Top 0.813: LED5.C 383.45,16.21 R128.1
N$2
  Top 0.254: U1.4 335.85,27.24 336.04,27.43 338.84,27.43 339.34,27.94 346.2,27.94 JP27.1
N$3
  Top 0.254: U1.5 335.22,28 335.11,28.11 334.26,28.96 24.89,28.96 20.32,24.38 VR1.P$2
  Top 0.305: C15.1 335.11,28.11
N$4
  Top 0.254: U1.6 334.58,27.7 334.09,28.19 72.14,28.19 68.58,24.64 VR2.P$2
  Top 0.305: U1.6 334.58,24.09 335.03,23.65 339.62,23.65 341.63,25.65 C16.1
N$5
  Top 0.254: U1.7 333.95,27.43 119.63,27.43 116.84,24.64 VR3.P$2
  Top 0.305: U1.7 333.95,23.43 334.52,22.86 340.78,22.86 C21.1
N$6
  Top 0.254: U1.8 333.31,26.42 325.63,26.42 166.12,26.42 165.35,25.65 VR4.P$2
  Top 0.813: C22.1 325.63,25.23 325.63,26.42
N$7
  Bottom 0.305: S2.1 383.54,16.59 383.54,9.91 385.08,8.37 J4.2
N$8  (via drill 0.35)
  Top 0.254: 331.98,20.64 321.63,20.64 v321.56,20.57 | 331.98,20.14 U1.9
  Top 0.813: C24.1 331.98,21.68 331.98,20.64 331.98,20.14
  Bottom 0.254: v321.56,20.57 320.8,20.57 319.53,19.3 214.88,19.3 213.61,18.03 VR5.P$2
N$9
  Top 0.254: U1.10 333.95,18.48 330.71,15.24 329.44,15.24 | VR6.P$2 261.87,18.54 262.64,19.3 267.21,19.3 267.46,19.05 299.21,19.05 303.53,14.73 329.44,14.73
  Top 0.813: C25.1 329.44,15.24 329.44,14.73
N$10  (via drill 0.35)
  Top 1.016: LED5.A 376.98,14.43 v376.94,14.48
  Bottom 1.016: J4.3 382.25,6.37 376.94,11.68 v376.94,14.48
N$11
  Top 0.254: U1.11 334.52,20.2 334.52,21.34 332.49,23.37 331.22,23.37 319.53,23.37 315.72,19.56 311.4,19.56 310.13,18.29 VR7.P$2
  Top 0.813: C26.1 331.22,24.47 331.22,23.37
N$12
  Top 0.254: VR8.P$2 358.39,19.05 356.62,20.83 351.96,20.83 C27.1 351.79,20.83 350.52,22.1 335.79,22.1 335.22,21.53 U1.12
N$13  (via drill 0.35)
  Top 1.016: LED6.A v386.59,17.27
  Bottom 1.016: v386.59,17.27 389.38,14.48 389.38,5.08 388.62,4.32 386.38,4.32 J4.4
N$14
  Top 0.254: U1.3 336.49,24.73 337.06,24.16 338.35,24.16 341.12,26.92 344.17,26.92 345.95,25.15 347.98,25.15 348.74,25.91 JP27.2
N$15
  Top 0.305: R125.2 188.63,13.72 186.69,13.72 186.18,13.21 186.18,12.45 186.56,12.07 U20.2
N$16
  Top 0.254: IC1.9 61.47,79.76 60.71,78.99
  Top 0.61: 60.71,78.99 R37.1 R5.2 R33.2
N$17
  Top 0.254: IC1.13 64.01,80 64.02,80 65.28,78.74 R38.1
  Top 0.61: R38.1 R34.2 R35.2
N$18  (via drill 0.35)
  Top 0.254: IC1.14 64.97,80.52 66.29,80.52
  Top 0.61: 66.29,80.52 67.14,79.67 R38.2
  Top 1.016: v68.83,79.25 68.33,78.74 R38.2
  Bottom 1.016: STEREO_OUT.TIP 29.13,68.05 32.24,69.09 33.01,69.86 38.61,69.83 | 38.61,69.83 46.72,69.83 49.02,72.14 58.67,72.14 59.18,71.63 65.79,71.63 69.6,75.44 69.6,78.99 69.34,79.25 v68.83,79.25 | J2.2 35.58,77.22 37.08,77.22 38.61,75.69 38.61,69.83
N$19  (via drill 0.35)
  Top 0.254: IC1.8 60.5,80.52
  Top 0.61: R37.2 58.33,79.67 59.18,80.52 60.5,80.52
  Top 1.016: v55.88,80.26 57.06,80.26 R37.2
  Bottom 1.016: STEREO_OUT.RING 29.97,78.25 31.24,79.52 35.88,79.52 | 35.88,79.52 39.14,79.52 40.39,80.77 55.37,80.77 v55.88,80.26 | J2.1 35.88,79.52
N$20
  Bottom 0.254: X6.19 400.56,60.71 401.57,59.69 404.37,59.69 405.64,58.42 405.64,25.91 406.15,25.4 417.83,25.4 420.62,22.61 JP24.1
N$21  (via drill 0.35)
  Top 0.254: v61.85,83.97 61.85,83.72 62.12,83.98 62.1,84 IC1.5
  Top 0.61: J2.3 35.54,75.18 33.02,75.18 29.46,71.63 29.46,53.85 28.68,53.07 FB_IN.TIP
  Bottom 1.016: FB_IN.TIP 28.94,53.07 29.46,53.59 29.46,63.25 33.78,67.56 46.99,67.56 49.28,69.85 67.06,69.85 71.37,74.17 71.37,80.01 67.92,83.46 62.36,83.46 v61.85,83.97
N$22
  Bottom 0.254: X6.20 404.11,62.23 408.69,57.66 417.32,57.66 420.62,54.36 JP25.1
N$23
  Bottom 0.254: JP23.1 420.62,64.26 419.35,65.53 406.91,65.53 406.15,64.77 X6.18
N$24
  Bottom 0.254: JP22.1 418.85,80.77 418.08,81.53 410.97,81.53 406.91,77.47 406.91,67.82 405.13,66.04 401.83,66.04 X6.17
N$25  (via drill 0.35)
  Top 0.254: U1.2 337.12,26.73 337.31,26.92 v339.85,26.92
  Bottom 0.254: v339.85,26.92 340.36,27.43 343.66,27.43 345.95,25.15 350.52,25.15 351.28,25.91 JP27.3
N$26
  Top 0.813: L1.1 R3.2
N$27
  Top 0.254: R159.1 64.68,88.14 64.05,87.51 64.01,87.38 IC1.2 64.01,87.51 64.12,87.63 64.43,87.63 C28.1
  Top 0.406: R160.2 65.36,91.61 64.68,90.93 R159.1
  Top 0.61: R160.2 R161.2 R162.2
N$105
  Top 0.254: C121.2 34.8,54.61 34.67,54.48
  Top 0.813: R111.1 44.45,55.97 VREGGND.1
  Top 1.016: VREGGND.1 U$3.P$2 35.56,55.37 34.8,54.61 | C11.2 34.63,53.94 34.67,54.48
N$106
  Top 0.813: VREGIN.1 46.39,50.89 R110.1
  Top 1.016: VREGIN.1 U$3.P$1 35.81,52.07 34.96,52.07 C121.1 C11.1
N$145
  Bottom 0.305: S1.1 386.79,21.11 384.81,19.21 384.81,11.89 J4.1
N$174
  Top 0.254: U20.3 186.19,11.42 185.42,12.19 185.42,13.63 R134.1
N$196
  Top 1.016: LED6.C 395.18,14.09 R129.1
N$249
  Top 0.61: R10.1 51.31,85.2 C158.-
N$265
  Top 0.406: 53,91.02 53.09,90.93 R11.2
  Top 0.61: 53,91.02 R10.2 49.02,93.31 JP14.1 | J36.1 56.69,94.79 53.25,91.35 R11.2
  Top 1.016: R10.2 50.84,91.48 43.92,84.56 MONO_OUT.TIP
  Bottom 0.61: J36.1 J36.2
N$284
  Top 0.254: R209.2 59.26,65.62 59.09,65.62 58.67,66.04 X7.15
N$293
  Top 0.254: X7.11 R208.2
N$294
  Top 0.254: X7.7 R112.2
N$299
  Top 0.254: 3V3A_0C.1 118.11,51.03 JP9.12
N$309
  Top 0.406: 3V3A_0A.1 208.03,50.57 JP10.12
N$310
  Bottom 0.254: 3V3A_0B.1 297.43,50.34 JP11.12
PA0-0
  Top 0.254: JP1.4 120.65,53.09 119.38,51.82 119.38,49.71 JP9.13
PA0-2
  Bottom 0.305: JP2.4 210.57,52.58 209.3,51.31 209.3,49.2 JP10.13
PA0-3
  Bottom 0.305: JP15.4 299.97,52.32 298.7,51.05 298.7,48.92 JP11.13
PA1-2
  Bottom 0.305: JP2.3 213.11,53.11 JP10.14
PA1-3
  Bottom 0.305: JP11.14 299.9,50.98 JP15.3
PA1_1
  Top 0.254: JP1.3 123.19,53.57 JP9.14
PA2-0
  Top 0.254: JP1.2 125.73,53.09 124.46,51.82 124.46,49.28 123.65,48.46 JP9.15
PA2-2
  Bottom 0.305: JP2.2 215.65,52.32 214.38,51.05 214.38,48.77 213.59,47.98 JP10.15
PA2-3
  Bottom 0.305: JP11.15 303.78,49.07 303.78,52.32 JP15.2
PA3-2
  Bottom 0.305: JP2.1 217.42,54.36 217.42,55.12 216.66,55.88 214.88,55.88 214.38,55.37 214.38,51.84 JP10.16
PA3-3
  Top 0.305: JP15.1 305.56,51.56 303.02,51.56 302.44,50.98 JP11.16
PA3_1
  Bottom 0.254: JP1.1 128.27,54.1 126.49,55.88 124.97,55.88 124.46,55.37 124.46,52.07 123.44,51.05 123.19,51.05 JP9.16
REG+12V
  Top 0.61: C53.1 C9.1
  Top 0.813: IC5.IN 42.67,71.88 +15VA.1 41.4,70.36 U$3.P$5 35.98,66.13 C53.1
REG-12V
  Top 0.254: U$3.P$3 34.8,60.45 34.8,60.2 C54.2
  Top 0.406: C10.2 32.85,60.2 34.8,60.2
  Top 0.61: IC6.IN 43.31,78.61 41.4,76.71 -15VA.1
  Top 0.813: -15VA.1 41.15,74.42 39.62,72.9 39.62,70.87 38.1,69.34 37.85,69.34 36.32,67.82 31.5,67.82 30.73,67.06 30.73,60.71 31.25,60.19 36.32,60.19 U$3.P$3
SC0
  Top 0.406: JP12.3 47.24,10.92 51.82,15.49 58.17,15.49 61.47,12.19 75.18,12.19 78.23,15.24 107.95,15.24 110.24,12.95 124.46,12.95 126.49,14.99 156.21,14.99 161.06,10.13 186.69,10.13 186.7,10.13 187.62,10.13 U20.5
SC1  (via drill 0.35)
  Top 0.406: v160.02,7.62 161.22,8.82 U20.7
  Bottom 0.406: JP13.3 53.59,10.92 74.68,10.92 78.99,15.24 107.95,15.24 110.24,12.95 124.46,12.95 126.49,14.99 151.89,14.99 159.26,7.62 v160.02,7.62
SC2  (via drill 0.35)
  Top 0.406: v163.83,5.59 165.76,7.52 U20.9
  Bottom 0.406: JP16.3 107.19,10.67 115.32,2.54 152.15,2.54 154.69,5.08 163.32,5.08 v163.83,5.59
SC3
  Top 0.406: U20.11 167.76,6.22 165.35,3.81 161.04,3.81 153.92,10.92 150.11,10.92 JP17.3
SC4
  Top 0.254: U20.14 194.7,6.22 196.85,4.06 199.64,4.06 200.66,5.08 200.66,10.16 199.9,10.92 JP18.3
SC5  (via drill 0.35)
  Top 0.254: U20.16 191.42,7.52 v190.5,6.6
  Bottom 0.254: v190.5,6.6 190.5,5.59 191.77,4.32 195.66,4.32 196.14,3.83 196.32,3.83 196.34,3.81 239.27,3.81 244.09,8.64 244.09,10.16 244.6,10.67 JP19.3
SC6  (via drill 0.35)
  Top 0.254: v191.26,9.14 191.52,8.89 193.3,8.89 U20.18
  Bottom 0.254: v191.26,9.14 189.99,9.14 188.75,7.9 188.75,5.64 191.6,2.79 286.51,2.79 294.39,10.67 JP20.3
SC7
  Top 0.254: JP21.3 342.39,10.16 302.01,10.16 297.18,14.99 281.18,14.99 277.88,11.68 255.78,11.68 252.48,14.99 222,14.99 220.47,13.46 207.77,13.46 206.25,14.99 196.85,14.99 196.09,14.22 196.09,11.18 195.03,10.12 U20.20
SD0
  Top 0.406: U20.4 162.21,10.77 156.72,16.26 125.48,16.26 123.19,13.97 111.25,13.97 108.71,16.51 77.47,16.51 74.17,13.21 61.98,13.21 58.67,16.51 51.05,16.51 48.01,13.46 JP12.4
SD1  (via drill 0.35)
  Top 0.406: v159.51,9.4 159.58,9.47 U20.6
  Bottom 0.406: v159.51,9.4 152.65,16.26 125.48,16.26 123.19,13.97 111.25,13.97 108.71,16.51 77.47,16.51 74.17,13.21 JP13.4
SD2  (via drill 0.35)
  Top 0.406: U20.8 163.62,8.17 v161.8,6.35
  Bottom 0.406: v161.8,6.35 154.43,6.35 151.64,3.56 116.08,3.56 106.43,13.21 JP16.4
SD3
  Top 0.406: JP17.4 152.65,13.21 161.29,4.57 164.59,4.57 166.89,6.87 U20.10
SD4
  Top 0.254: U20.13 194.13,5.57 196.4,3.3 200.15,3.3 201.42,4.57 201.42,11.94 199.9,13.46 JP18.4
SD5  (via drill 0.35)
  Top 0.254: U20.15 192.02,6.86 191.52,6.35 v191.52,5.84
  Bottom 0.254: v191.52,5.84 192.28,5.08 195.58,5.08 196.34,4.32 238.76,4.32 243.08,8.64 243.08,12.7 243.59,13.21 JP19.4
SD6  (via drill 0.35)
  Top 0.254: U20.17 190.54,8.17 v190.5,8.13
  Bottom 0.254: v190.5,8.13 189.48,7.11 189.48,5.84 192.02,3.3 284.23,3.3 294.13,13.21 JP20.4
SD7  (via drill 0.35)
  Top 0.254: U20.19 192.21,9.47 191.52,10.16 v190.5,10.16
  Bottom 0.254: v190.5,10.16 189.48,10.16 187.96,8.64 187.96,5.49 191.14,2.31 335.56,2.31 338.84,5.59 338.84,10.41 341.63,13.21 JP21.4
SPI1_CS  (via drill 0.35)
  Top 0.254: X7.9 61.72,58.42 64.77,59.44 125.48,59.44 v126.36,58.55 129.79,55.12 129.79,52.07 129.54,51.82 129.54,50.29 129.03,49.78 127.02,49.78 JP9.17 | v204.22,53.34 204.22,53.59 206.5,55.88 219.2,55.88 220.22,54.86 220.22,52.83 219.1,51.71 217.72,51.71 217.65,51.79 217.14,51.79 216.92,51.56 216.92,49.28 216.89,49.28 JP10.17 217.6,45.97 v224.54,45.97 | v292.5,45.13 271.35,45.13 266.45,50.04 v266.32,49.91
  Bottom 0.254: v204.22,53.34 199.39,58.17 126.49,58.17 126.24,58.42 v126.36,58.55 | JP11.17 301.45,44.2 293.37,44.2 292.5,45.06 v292.5,45.13 | v266.32,49.91 265.05,49.91 262.64,52.32 237.49,52.32 231.14,45.97 v224.54,45.97
SPI1_MISO  (via drill 0.35)
  Top 0.254: R208.1 126.49,60.96 132.08,55.37 132.08,50.04 131.83,49.78 130.05,49.78 128.73,48.46 JP9.19 | v196.85,53.59 200.66,57.4 220.22,57.4 | 220.22,57.4 220.73,57.4 v222,56.13 | v220.73,57.91 220.22,57.4
  Bottom 0.254: JP9.19 128.25,46.76 129.79,45.21 163.32,45.21 171.7,53.59 v196.85,53.59 | v222,56.13 222,54.61 219.46,52.07 219.46,48.77 218.67,47.98 JP10.19 | JP11.19 308.81,49.02 308.86,49.02 308.86,51.82 309.37,52.32 309.37,55.88 307.34,57.91 v220.73,57.91
SPI1_MOSI  (via drill 0.35)
  Top 0.254: X7.12 54.1,59.69 63.14,59.69 65,60.25 125.93,60.25 v131.06,55.12 | v206.5,44.45 205.74,43.69 178.05,43.69 166.12,55.63 135.64,55.63 v133.35,53.34 | JP11.20 309.37,52.12 309.37,55.63 309.12,55.88 224.54,55.88 v224.28,55.63
  Bottom 0.254: v131.06,55.12 131.06,53.85 130.56,53.34 | JP9.20 128.25,51.03 130.56,53.34 | JP10.20 218.14,49.99 216.92,48.77 216.92,46.23 | 216.92,46.23 216.41,45.72 207.26,45.72 206.5,44.96 v206.5,44.45 | v133.35,53.34 130.56,53.34 | v224.28,55.63 224.28,54.61 222,52.32 222,46.99 220.98,45.97 217.17,45.97 216.92,46.23
SPI1_SCK  (via drill 0.35)
  Top 0.254: X7.10 54.1,57.15 61.21,57.15 65.02,58.67 123.95,58.67 127,55.63 127,52.27 125.74,51 JP9.18 | v202.18,44.96 204.22,46.99 204.22,49.02 204.47,49.28 214.38,49.28 215.59,50.49 JP10.18 214.38,49.3 214.38,46.74 215.9,45.21 231.14,45.21 237.24,51.31 280.16,51.31 282.7,48.77 283.21,48.77 283.46,49.02 304.55,49.02 304.98,49.45 JP11.18
  Bottom 0.254: JP9.18 124.48,49.78 124.46,49.78 124.46,46.23 126.24,44.45 163.73,44.45 168.72,49.44 170.98,49.44 175.97,44.45 201.42,44.45 201.93,44.96 v202.18,44.96
SPI2_CS
  Top 0.254: JP8.3 326.64,62.99 324.1,62.99 319.79,58.67 243.08,58.67 239.78,61.98 JP7.3 238.51,62.48 237.74,63.25 233.93,63.25 231.14,60.45 152.65,60.45 150.62,62.48 JP6.3 148.34,62.48 147.07,63.75 145.03,63.75 143.64,62.36 66.83,62.36 66.19,62.99 55.88,62.99 X7.13
SPI2_MISO  (via drill 0.35)
  Top 0.254: R209.1 66.12,65.53 v67.08,64.57
  Bottom 0.254: JP8.5 327.66,64.26 326.39,65.53 324.1,65.53 318.26,59.69 243.59,59.69 238.76,64.52 JP7.5 237.24,63.25 229.87,63.25 225.81,59.18 154.94,59.18 149.1,65.02 JP6.5 148.08,65.02 146.81,63.75 128.02,63.75 122.94,58.67 72.97,58.67 v67.08,64.57
SPI2_MOSI
  Top 0.254: X7.16 53.34,66.04 54.61,64.77 56.39,64.77 57.4,63.75 66.32,63.75 66.93,63.14 143.41,63.14 144.78,64.52 145.54,64.52 JP6.6 147.32,66.29 150.37,66.29 151.64,65.02 151.64,62.48 152.91,61.21 230.89,61.21 233.93,64.26 235.71,64.26 JP7.6 237.24,65.79 247.65,65.79 254,59.44 319.28,59.44 324.1,64.26 JP8.6
SPI2_SCK
  Top 0.254: X7.14 53.09,63.5 54.36,62.23 66.04,62.23 66.55,61.72 145.29,61.72 JP6.4 147.32,61.21 150.11,61.21 151.89,59.44 231.9,59.44 234.44,61.98 JP7.4 236.98,60.96 236.98,60.71 239.27,60.71 242.32,57.66 320.55,57.66 324.61,61.72 JP8.4
SPI5_CS
  Top 0.254: JP11.9 294.82,45.39 293.37,43.94 268.99,43.94 262.89,50.04 237.74,50.04 231.9,44.2 209.22,44.2 JP10.9
  Top 0.305: X7.5 58.17,50.55 58.17,45.72 59.44,44.45 113.28,44.45 115.82,46.99 115.82,48.18 JP9.9
  Bottom 0.254: JP10.9 205.44,46.43 202.95,43.94 118.87,43.94 115.54,47.27 JP9.9
SPI5_MISO
  Top 0.254: R112.1 65.28,57.91 111,57.91 116.84,52.07 116.84,50.29 116.33,49.78 113.79,49.78 113,49 JP9.7
  Bottom 0.254: JP9.7 113,46 115.68,43.32 203.96,43.32 | 203.96,43.32 208.17,43.32 209.55,44.7 231.65,44.7 237.49,50.55 263.14,50.55 268.99,44.7 289.81,44.7 292.28,47.17 JP11.7 | JP10.7 202.9,48.72 203.45,49.28 206.25,49.28 206.76,48.77 206.76,46.23 204.34,43.81 204.34,43.7 203.96,43.32
SPI5_MOSI
  Top 0.254: JP11.8 292.28,51.29 288.69,54.88 221.53,54.57 219.71,56.39 205.74,56.39 202.9,53.54 JP10.8
  Bottom 0.254: JP10.8 196.77,56.64 118.11,56.64 116.59,55.12 116.59,52.32 116.84,52.07 116.84,50.29 116.33,49.78 114.27,49.78 113.03,51.03
  Bottom 0.305: X7.8 54.13,54.58 62.45,54.58 64.77,56.9 108.2,56.9 113.03,52.07 113.03,51.03 JP9.8
SPI5_SCK
  Top 0.305: X7.6 53.36,53.34 54.6,54.58 62.96,54.58 65.53,57.15 109.47,57.15 115.54,51.08 JP9.10
  Bottom 0.254: JP9.10 115.54,55.09 117.86,57.4 198.55,57.4 JP10.10 205.44,53.54 208.79,56.9 289.56,56.9 294.82,51.64 JP11.10
TOUCH1  (via drill 3.17 pad 6.1)
  Top 0.203: 408.18,86.61 401.32,86.61 400.56,85.85 X6.1
  Top 0.254: 415.4,93.84 408.18,86.61
  Top 0.508: 415.4,93.84 v415.45,93.84
TOUCH2  (via drill 3.17 pad 6.1)
  Top 0.254: v415.45,85.78 403.79,85.78 X6.2
TOUCH3  (via drill 3.17 pad 6.1)
  Top 0.254: v415.45,77.72 409.35,83.82 401.57,83.82 400.56,82.8 X6.3
TOUCH4  (via drill 3.17 pad 6.1)
  Top 0.254: X6.4 408.43,82.55 410.46,80.52 410.46,74.42 415.22,69.67 v415.45,69.67
TOUCH5  (via drill 3.17 pad 6.1)
  Top 0.254: X6.5 401.83,81.28 408.18,81.28 409.7,79.76 409.7,67.36 v415.45,61.61
TOUCH6  (via drill 3.17 pad 6.1)
  Top 0.254: X6.6 407.92,80.01 408.94,78.99 408.94,59.44 414.82,53.56 v415.45,53.56
TOUCH7  (via drill 3.17 pad 6.1)
  Top 0.254: X6.7 401.83,78.74 407.42,78.74 408.18,77.98 408.18,52.77 v415.45,45.5
TOUCH8  (via drill 3.17 pad 6.1)
  Route15 0.254: X6.8 408.43,77.47 410.72,75.18 410.72,41.91 415.18,37.45 v415.45,37.45
TOUCH9  (via drill 3.17 pad 6.1)
  Route15 0.254: X6.9 401.83,76.2 408.18,76.2 409.96,74.42 409.96,33.78 414.35,29.39 v415.45,29.39
TOUCH10  (via drill 3.17 pad 6.1)
  Route15 0.254: X6.10 407.42,74.93 408.94,73.41 408.94,27.84 v415.45,21.34
TOUCH11  (via drill 3.17 pad 6.1)
  Route15 0.254: X6.11 401.83,73.66 406.91,73.66 407.92,72.64 407.92,20.8 v415.45,13.28
TOUCH12  (via drill 3.17 pad 6.1)
  Route15 0.254: X6.12 405.89,72.39 406.91,71.37 406.91,11.94 413.62,5.22 v415.45,5.22

## Text on the board
tPlace: G | EXP | H | + | -
Patch_BOT: Lout | Rout | DGND | 5Vin | Lout | Rout | 5Vin | Lout | Rout | DGND | DGND | 5Vin | I2C4 | PD13 | PC6 | SDA | PC6 | PD13 | PD13 | SDA | PC6 | SCL | PD12 | D11 | SCL | D11 | SCL | PD12 | PD12 | D11 | Lin | Rin | Lin | Rin | Lin | MOSI | PB15 | PB14 | MISO | MOSI | PB15 | PB14 | Rin | MOSI | PB14 | MISO | PB15 | SCLK | PB13 | PB12 | CS | SCLK | PB13 | PB12 | SCLK | PB13 | PB12 | CS | 3v3a | PG10 | 3v3D | DGND | 3v3a | PG10 | 3v3D | DGND | 3v3a | PG10 | 3v3D | DGND | PA1 | PA3 | PA5 | PA7 | PC5 | PB1 | PD7 | SCL | PA3 | PA5 | PA7 | PC5 | PB1 | PD7 | SCL | PA3 | PA5 | PC5 | PA1 | PA1 | PA7 | PB1 | PD7 | SCL | AGND | PA4 | PA6 | PC4 | PB0 | SDA | PA0 | PA2 | PG9 | PG12 | AGND | PA0 | PA2 | PA4 | PA6 | PC4 | PB0 | PG9 | PG12 | SDA | AGND | PA0 | PA2 | PA4 | PA6 | PC4 | PB0 | PG9 | PG12 | SDA